# Altium schematic sheet 01_DDR3L_256Mx32bits.SchDoc
size A4; SheetNumber: 2; SheetTotal: 11
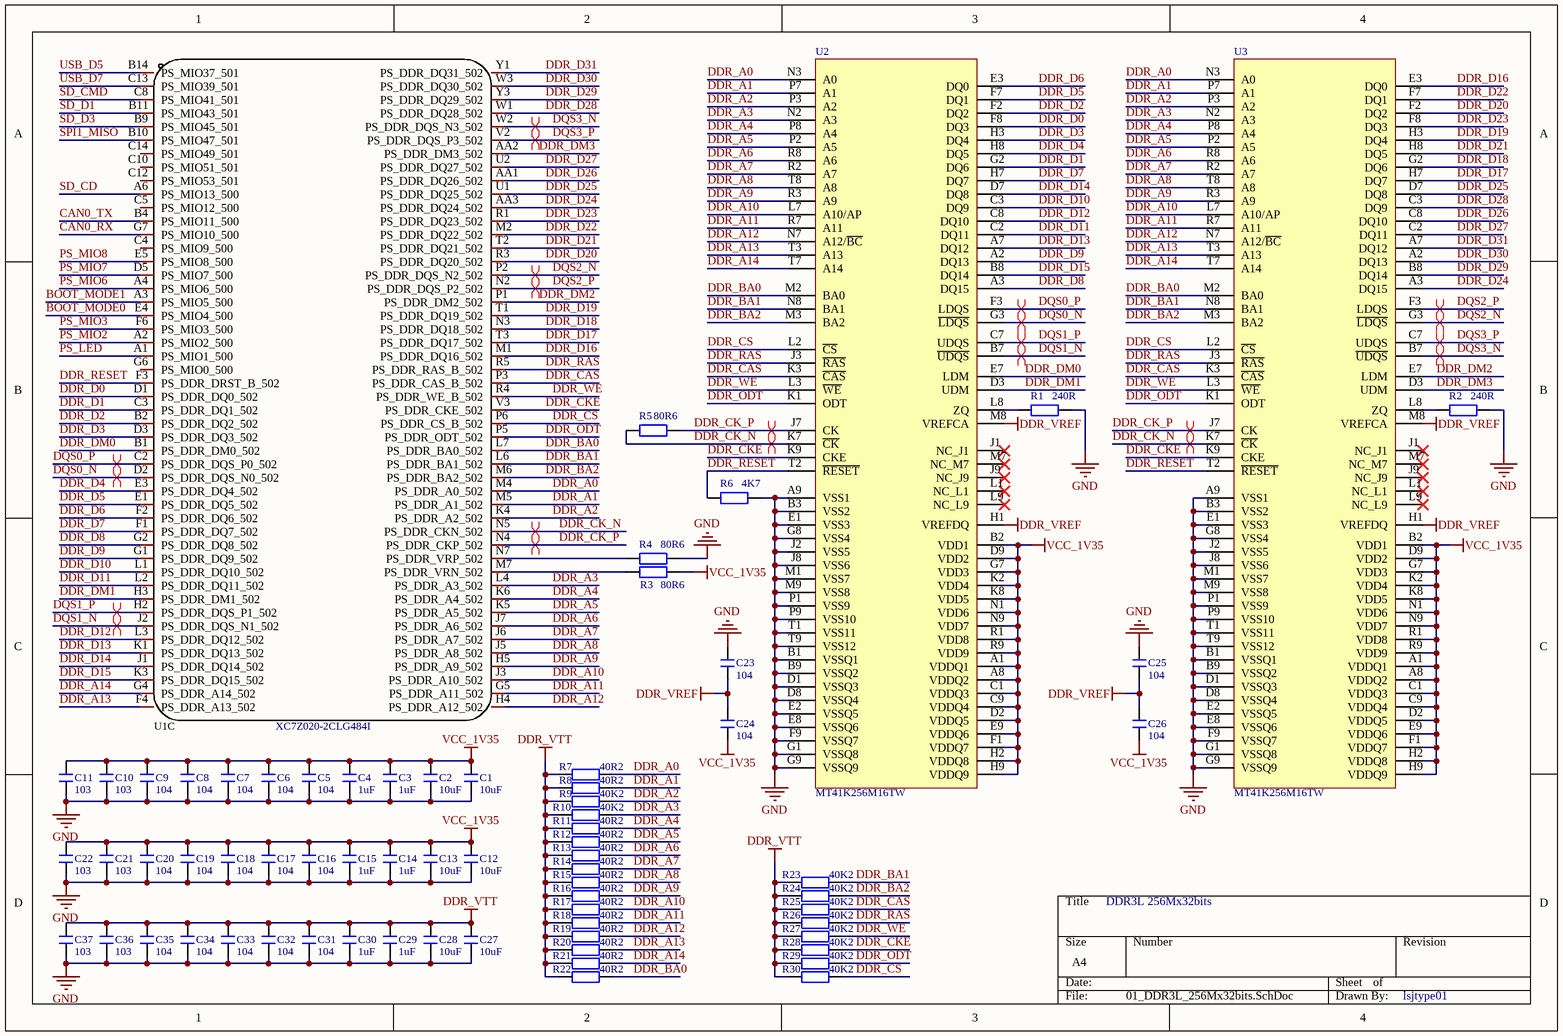
[diagram p0: 01_DDR3L_256Mx32bits.SchDoc]

## Parts
C1  10uF  [C 0603]
C2  10uF  [C 0603]
C3  1uF  [C 0402]
C4  1uF  [C 0402]
C5  104  [C 0402]
C6  104  [C 0402]
C7  104  [C 0402]
C8  104  [C 0402]
C9  104  [C 0402]
C10  103  [C 0402]
C11  103  [C 0402]
C12  10uF  [C 0603]
C13  10uF  [C 0603]
C14  1uF  [C 0402]
C15  1uF  [C 0402]
C16  104  [C 0402]
C17  104  [C 0402]
C18  104  [C 0402]
C19  104  [C 0402]
C20  104  [C 0402]
C21  103  [C 0402]
C22  103  [C 0402]
C23  104  [C 0402]
C24  104  [C 0402]
C25  104  [C 0402]
C26  104  [C 0402]
C27  10uF  [C 0603]
C28  10uF  [C 0603]
C29  1uF  [C 0402]
C30  1uF  [C 0402]
C31  104  [C 0402]
C32  104  [C 0402]
C33  104  [C 0402]
C34  104  [C 0402]
C35  104  [C 0402]
C36  103  [C 0402]
C37  103  [C 0402]
R1  240R  [R 0402]
R2  240R  [R 0402]
R3  80R6  [R 0402]
R4  80R6  [R 0402]
R5  80R6  [R 0402]
R6  4K7  [R 0402]
R7  40R2  [R 0402]
R8  40R2  [R 0402]
R9  40K2  [R 0402]
R10  40K2  [R 0402]
R11  40R2  [R 0402]
R12  40R2  [R 0402]
R13  40R2  [R 0402]
R14  40R2  [R 0402]
R15  40R2  [R 0402]
R16  40R2  [R 0402]
R17  40R2  [R 0402]
R18  40R2  [R 0402]
R19  40R2  [R 0402]
R20  40R2  [R 0402]
R21  40R2  [R 0402]
R22  40R2  [R 0402]
R23  40K2  [R 0402]
R24  40K2  [R 0402]
R25  40K2  [R 0402]
R26  40K2  [R 0402]
R27  40K2  [R 0402]
R28  40K2  [R 0402]
R29  40K2  [R 0402]
R30  40K2  [R 0402]
U1  XC7Z020-2CLG484I  [CSPBGA-484]  (part C of 4)
U2  MT41K256M16TW  [FBGA_96]
U3  MT41K256M16TW  [FBGA_96]

## Nets
DDR_VREF: C23.2 C24.1 C25.2 C26.1 U2.H1(VREFDQ) U2.M8(VREFCA) U3.H1(VREFDQ) U3.M8(VREFCA)
DDR_VTT: C27.2 C28.1 C29.1 C30.1 C31.1 C32.1 C33.1 C34.1 C35.1 C36.1 C37.1 R7.1 R8.1 R9.1 R10.1 R11.1 R12.1 R13.1 R14.1 R15.1 R16.1 R17.1 R18.1 R19.1 R20.1 R21.1 R22.1 R23.1 R24.1 R25.1 R26.1 R27.1 R28.1 R29.1 R30.1
GND: C1.1 C2.1 C3.1 C4.1 C5.1 C6.1 C7.1 C8.1 C9.1 C10.1 C11.1 C12.1 C13.1 C14.1 C15.1 C16.1 C17.1 C18.1 C19.1 C20.1 C21.1 C22.1 C23.1 C25.1 C27.1 C28.2 C29.2 C30.2 C31.2 C32.2 C33.2 C34.2 C35.2 C36.2 C37.2 R1.2 R2.2 R4.2 R6.1 U2.A9(VSS1) U2.B1(VSSQ1) U2.B3(VSS2) U2.B9(VSSQ2) U2.D1(VSSQ3) U2.D8(VSSQ4) U2.E1(VSS3) U2.E2(VSSQ5) U2.E8(VSSQ6) U2.F9(VSSQ7) U2.G1(VSSQ8) U2.G8(VSS4) U2.G9(VSSQ9) U2.J2(VSS5) U2.J8(VSS6) U2.M1(VSS7) U2.M9(VSS8) U2.P1(VSS9) U2.P9(VSS10) U2.T1(VSS11) U2.T9(VSS12) U3.A9(VSS1) U3.B1(VSSQ1) U3.B3(VSS2) U3.B9(VSSQ2) U3.D1(VSSQ3) U3.D8(VSSQ4) U3.E1(VSS3) U3.E2(VSSQ5) U3.E8(VSSQ6) U3.F9(VSSQ7) U3.G1(VSSQ8) U3.G8(VSS4) U3.G9(VSSQ9) U3.J2(VSS5) U3.J8(VSS6) U3.M1(VSS7) U3.M9(VSS8) U3.P1(VSS9) U3.P9(VSS10) U3.T1(VSS11) U3.T9(VSS12)
VCC_1V35: C1.2 C2.2 C3.2 C4.2 C5.2 C6.2 C7.2 C8.2 C9.2 C10.2 C11.2 C12.2 C13.2 C14.2 C15.2 C16.2 C17.2 C18.2 C19.2 C20.2 C21.2 C22.2 C24.2 C26.2 R3.2 U2.A1(VDDQ1) U2.A8(VDDQ2) U2.B2(VDD1) U2.C1(VDDQ3) U2.C9(VDDQ4) U2.D2(VDDQ5) U2.D9(VDD2) U2.E9(VDDQ6) U2.F1(VDDQ7) U2.G7(VDD3) U2.H2(VDDQ8) U2.H9(VDDQ9) U2.K2(VDD4) U2.K8(VDD5) U2.N1(VDD6) U2.N9(VDD7) U2.R1(VDD8) U2.R9(VDD9) U3.A1(VDDQ1) U3.A8(VDDQ2) U3.B2(VDD1) U3.C1(VDDQ3) U3.C9(VDDQ4) U3.D2(VDDQ5) U3.D9(VDD2) U3.E9(VDDQ6) U3.F1(VDDQ7) U3.G7(VDD3) U3.H2(VDDQ8) U3.H9(VDDQ9) U3.K2(VDD4) U3.K8(VDD5) U3.N1(VDD6) U3.N9(VDD7) U3.R1(VDD8) U3.R9(VDD9)
BOOT_MODE0: U1.E4(PS_MIO4_500)
BOOT_MODE1: U1.A3(PS_MIO5_500)
CAN0_RX: U1.G7(PS_MIO10_500)
CAN0_TX: U1.B4(PS_MIO11_500)
DDR_A0: R7.2 U1.M4(PS_DDR_A0_502) U2.N3(A0) U3.N3(A0)
DDR_A1: R8.2 U1.M5(PS_DDR_A1_502) U2.P7(A1) U3.P7(A1)
DDR_A2: R9.2 U1.K4(PS_DDR_A2_502) U2.P3(A2) U3.P3(A2)
DDR_A3: R10.2 U1.L4(PS_DDR_A3_502) U2.N2(A3) U3.N2(A3)
DDR_A4: R11.2 U1.K6(PS_DDR_A4_502) U2.P8(A4) U3.P8(A4)
DDR_A5: R12.2 U1.K5(PS_DDR_A5_502) U2.P2(A5) U3.P2(A5)
DDR_A6: R13.2 U1.J7(PS_DDR_A6_502) U2.R8(A6) U3.R8(A6)
DDR_A7: R14.2 U1.J6(PS_DDR_A7_502) U2.R2(A7) U3.R2(A7)
DDR_A8: R15.2 U1.J5(PS_DDR_A8_502) U2.T8(A8) U3.T8(A8)
DDR_A9: R16.2 U1.H5(PS_DDR_A9_502) U2.R3(A9) U3.R3(A9)
DDR_A10: R17.2 U1.J3(PS_DDR_A10_502) U2.L7(A10/AP) U3.L7(A10/AP)
DDR_A11: R18.2 U1.G5(PS_DDR_A11_502) U2.R7(A11) U3.R7(A11)
DDR_A12: R19.2 U1.H4(PS_DDR_A12_502) U2.N7(A12/~{BC}) U3.N7(A12/~{BC})
DDR_A13: R20.2 U1.F4(PS_DDR_A13_502) U2.T3(A13) U3.T3(A13)
DDR_A14: R21.2 U1.G4(PS_DDR_A14_502) U2.T7(A14) U3.T7(A14)
DDR_BA0: R22.2 U1.L7(PS_DDR_BA0_502) U2.M2(BA0) U3.M2(BA0)
DDR_BA1: R23.2 U1.L6(PS_DDR_BA1_502) U2.N8(BA1) U3.N8(BA1)
DDR_BA2: R24.2 U1.M6(PS_DDR_BA2_502) U2.M3(BA2) U3.M3(BA2)
DDR_CAS: R25.2 U1.P3(PS_DDR_CAS_B_502) U2.K3(~{CAS}) U3.K3(~{CAS})
DDR_CK_N: R5.2 U1.N5(PS_DDR_CKN_502) U2.K7(~{CK}) U3.K7(~{CK})
DDR_CK_P: R5.1 U1.N4(PS_DDR_CKP_502) U2.J7(CK) U3.J7(CK)
DDR_CKE: R28.2 U1.V3(PS_DDR_CKE_502) U2.K9(CKE) U3.K9(CKE)
DDR_CS: R30.2 U1.P6(PS_DDR_CS_B_502) U2.L2(~{CS}) U3.L2(~{CS})
DDR_D0: U1.D1(PS_DDR_DQ0_502) U2.F8(DQ3)
DDR_D1: U1.C3(PS_DDR_DQ1_502) U2.G2(DQ6)
DDR_D2: U1.B2(PS_DDR_DQ2_502) U2.F2(DQ2)
DDR_D3: U1.D3(PS_DDR_DQ3_502) U2.H3(DQ4)
DDR_D4: U1.E3(PS_DDR_DQ4_502) U2.H8(DQ5)
DDR_D5: U1.E1(PS_DDR_DQ5_502) U2.F7(DQ1)
DDR_D6: U1.F2(PS_DDR_DQ6_502) U2.E3(DQ0)
DDR_D7: U1.F1(PS_DDR_DQ7_502) U2.H7(DQ7)
DDR_D8: U1.G2(PS_DDR_DQ8_502) U2.A3(DQ15)
DDR_D9: U1.G1(PS_DDR_DQ9_502) U2.A2(DQ13)
DDR_D10: U1.L1(PS_DDR_DQ10_502) U2.C3(DQ9)
DDR_D11: U1.L2(PS_DDR_DQ11_502) U2.C2(DQ11)
DDR_D12: U1.L3(PS_DDR_DQ12_502) U2.C8(DQ10)
DDR_D13: U1.K1(PS_DDR_DQ13_502) U2.A7(DQ12)
DDR_D14: U1.J1(PS_DDR_DQ14_502) U2.D7(DQ8)
DDR_D15: U1.K3(PS_DDR_DQ15_502) U2.B8(DQ14)
DDR_D16: U1.M1(PS_DDR_DQ16_502) U3.E3(DQ0)
DDR_D17: U1.T3(PS_DDR_DQ17_502) U3.H7(DQ7)
DDR_D18: U1.N3(PS_DDR_DQ18_502) U3.G2(DQ6)
DDR_D19: U1.T1(PS_DDR_DQ19_502) U3.H3(DQ4)
DDR_D20: U1.R3(PS_DDR_DQ20_502) U3.F2(DQ2)
DDR_D21: U1.T2(PS_DDR_DQ21_502) U3.H8(DQ5)
DDR_D22: U1.M2(PS_DDR_DQ22_502) U3.F7(DQ1)
DDR_D23: U1.R1(PS_DDR_DQ23_502) U3.F8(DQ3)
DDR_D24: U1.AA3(PS_DDR_DQ24_502) U3.A3(DQ15)
DDR_D25: U1.U1(PS_DDR_DQ25_502) U3.D7(DQ8)
DDR_D26: U1.AA1(PS_DDR_DQ26_502) U3.C8(DQ10)
DDR_D27: U1.U2(PS_DDR_DQ27_502) U3.C2(DQ11)
DDR_D28: U1.W1(PS_DDR_DQ28_502) U3.C3(DQ9)
DDR_D29: U1.Y3(PS_DDR_DQ29_502) U3.B8(DQ14)
DDR_D30: U1.W3(PS_DDR_DQ30_502) U3.A2(DQ13)
DDR_D31: U1.Y1(PS_DDR_DQ31_502) U3.A7(DQ12)
DDR_DM0: U1.B1(PS_DDR_DM0_502) U2.E7(LDM)
DDR_DM1: U1.H3(PS_DDR_DM1_502) U2.D3(UDM)
DDR_DM2: U1.P1(PS_DDR_DM2_502) U3.E7(LDM)
DDR_DM3: U1.AA2(PS_DDR_DM3_502) U3.D3(UDM)
DDR_ODT: R29.2 U1.P5(PS_DDR_ODT_502) U2.K1(ODT) U3.K1(ODT)
DDR_RAS: R26.2 U1.R5(PS_DDR_RAS_B_502) U2.J3(~{RAS}) U3.J3(~{RAS})
DDR_RESET: R6.2 U1.F3(PS_DDR_DRST_B_502) U2.T2(~{RESET}) U3.T2(~{RESET})
DDR_WE: R27.2 U1.R4(PS_DDR_WE_B_502) U2.L3(~{WE}) U3.L3(~{WE})
DQS0_N: U1.D2(PS_DDR_DQS_N0_502) U2.G3(~{LDQS})
DQS0_P: U1.C2(PS_DDR_DQS_P0_502) U2.F3(LDQS)
DQS1_N: U1.J2(PS_DDR_DQS_N1_502) U2.B7(~{UDQS})
DQS1_P: U1.H2(PS_DDR_DQS_P1_502) U2.C7(UDQS)
DQS2_N: U1.P2(PS_DDR_DQS_N2_502) U3.G3(~{LDQS})
DQS2_P: U1.N2(PS_DDR_DQS_P2_502) U3.F3(LDQS)
DQS3_N: U1.W2(PS_DDR_DQS_N3_502) U3.B7(~{UDQS})
DQS3_P: U1.V2(PS_DDR_DQS_P3_502) U3.C7(UDQS)
PS_LED: U1.A1(PS_MIO1_500)
PS_MIO2: U1.A2(PS_MIO2_500)
PS_MIO3: U1.F6(PS_MIO3_500)
PS_MIO6: U1.A4(PS_MIO6_500)
PS_MIO7: U1.D5(PS_MIO7_500)
PS_MIO8: U1.E5(PS_MIO8_500)
SD_CD: U1.A6(PS_MIO13_500)
SD_CMD: U1.C8(PS_MIO41_501)
SD_D1: U1.B11(PS_MIO43_501)
SD_D3: U1.B9(PS_MIO45_501)
SPI1_MISO: U1.B10(PS_MIO47_501)
USB_D5: U1.B14(PS_MIO37_501)
USB_D7: U1.C13(PS_MIO39_501)
NetR1_1: R1.1 U2.L8(ZQ)
NetR2_1: R2.1 U3.L8(ZQ)
NetR3_1: R3.1 U1.M7(PS_DDR_VRN_502)
NetR4_1: R4.1 U1.N7(PS_DDR_VRP_502)

Not connected (* = marked no-connect by the designer): U1 C4(PS_MIO9_500) C5(PS_MIO12_500) C10(PS_MIO51_501) C12(PS_MIO53_501) C14(PS_MIO49_501) G6(PS_MIO0_500); U2 J1(NC_J1)* J9(NC_J9)* L1(NC_L1)* L9(NC_L9)* M7(NC_M7)*; U3 J1(NC_J1)* J9(NC_J9)* L1(NC_L1)* L9(NC_L9)* M7(NC_M7)*

## Layout directives
differential pair: DDR_CK_N, DDR_CK_P, DQS0_N, DQS0_P, DQS1_N, DQS1_P, DQS2_N, DQS2_P, DQS3_N, DQS3_P

## Notes on the sheet
- DDR3L 256Mx32bits
- lsjtype01

## Library data of the parts
C1-C37 = C: 无极性贴片电容; 版权归属: 源创客; BOM名称: 无极性贴片电容; 学习资源: www.ooocke.com
R1-R30 = R: 贴片电阻; 版权归属: 源创客; BOM名称: 贴片电阻; 学习资源: www.ooocke.com
U1 = XC7Z020-2CLG484I: Manufacturer: XILINX(赛灵思); Add into BOM: yes; Paste Type: expand; Name: XC7Z020-2CLG484I; Symbol: XC7Z020-2CLG484I; Device: XC7Z020-2CLG484I; LCSC Part Name: XC7Z020-2CLG484I; Supplier Part: C157624; Manufacturer Part: XC7Z020-2CLG484I; Supplier Footprint: CSPBGA-484; JLCPCB Part Class: Extended Part; Datasheet: https://atta.szlcsc.com/upload/public/pdf/source/20180115/C157624_15160149665121269420.pdf; Supplier: LCSC; Convert to PCB: yes; Assembly Type: smtWeld